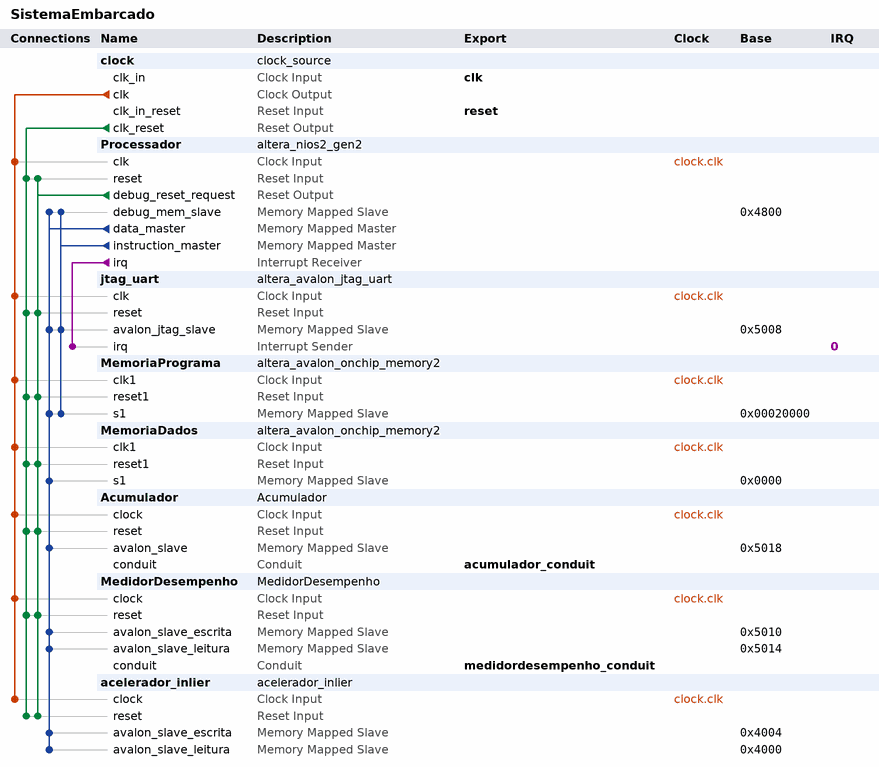
[diagram p0: system contents]
# Platform Designer (Qsys) system SistemaEmbarcado, Cyclone IV E EP4CE115F29C7
# Parameters at their usual value, and those the tool derives, are not listed.
package require -exact qsys 18.1
create_system SistemaEmbarcado
set_project_property DEVICE_FAMILY {Cyclone IV E}
set_project_property DEVICE EP4CE115F29C7

add_instance clock clock_source 18.1
set_instance_parameter_value clock clockFrequency 50000000

add_instance Processador altera_nios2_gen2 18.1
set_instance_parameter_value Processador dcache_size 2048
set_instance_parameter_value Processador exceptionSlave MemoriaPrograma.s1
set_instance_parameter_value Processador icache_size 4096
set_instance_parameter_value Processador impl Tiny
set_instance_parameter_value Processador resetSlave MemoriaPrograma.s1

add_instance jtag_uart altera_avalon_jtag_uart 18.1
set_instance_parameter_value jtag_uart simInteractiveOptions NO_INTERACTIVE_WINDOWS

add_instance MemoriaPrograma altera_avalon_onchip_memory2 18.1
set_instance_parameter_value MemoriaPrograma dataWidth 32
set_instance_parameter_value MemoriaPrograma dualPort false
set_instance_parameter_value MemoriaPrograma initMemContent true
set_instance_parameter_value MemoriaPrograma initializationFileName onchip_mem.hex
set_instance_parameter_value MemoriaPrograma memorySize 65536

add_instance MemoriaDados altera_avalon_onchip_memory2 18.1
set_instance_parameter_value MemoriaDados dataWidth 32
set_instance_parameter_value MemoriaDados dualPort false
set_instance_parameter_value MemoriaDados initMemContent false
set_instance_parameter_value MemoriaDados initializationFileName D:/Projetos/Quartus/AcumuladorNios/MemoriaDados.mif
set_instance_parameter_value MemoriaDados memorySize 16384

add_instance Acumulador Acumulador 1.0

add_instance MedidorDesempenho MedidorDesempenho 1.0

add_instance acelerador_inlier acelerador_inlier 1.0

# connections
add_connection clock.clk acelerador_inlier.clock clock
add_connection clock.clk Acumulador.clock clock
add_connection clock.clk jtag_uart.clk clock
add_connection clock.clk MedidorDesempenho.clock clock
add_connection clock.clk MemoriaDados.clk1 clock
add_connection clock.clk MemoriaPrograma.clk1 clock
add_connection clock.clk Processador.clk clock
add_connection clock.clk_reset acelerador_inlier.reset reset
add_connection clock.clk_reset Acumulador.reset reset
add_connection clock.clk_reset jtag_uart.reset reset
add_connection clock.clk_reset MedidorDesempenho.reset reset
add_connection clock.clk_reset MemoriaDados.reset1 reset
add_connection clock.clk_reset MemoriaPrograma.reset1 reset
add_connection clock.clk_reset Processador.reset reset
add_connection Processador.debug_reset_request acelerador_inlier.reset reset
add_connection Processador.debug_reset_request Acumulador.reset reset
add_connection Processador.debug_reset_request jtag_uart.reset reset
add_connection Processador.debug_reset_request MedidorDesempenho.reset reset
add_connection Processador.debug_reset_request MemoriaDados.reset1 reset
add_connection Processador.debug_reset_request MemoriaPrograma.reset1 reset
add_connection Processador.debug_reset_request Processador.reset reset
add_connection Processador.data_master acelerador_inlier.avalon_slave_escrita avalon
set_connection_parameter_value Processador.data_master/acelerador_inlier.avalon_slave_escrita baseAddress 0x4004
add_connection Processador.data_master acelerador_inlier.avalon_slave_leitura avalon
set_connection_parameter_value Processador.data_master/acelerador_inlier.avalon_slave_leitura baseAddress 0x4000
add_connection Processador.data_master Acumulador.avalon_slave avalon
set_connection_parameter_value Processador.data_master/Acumulador.avalon_slave baseAddress 0x5018
add_connection Processador.data_master jtag_uart.avalon_jtag_slave avalon
set_connection_parameter_value Processador.data_master/jtag_uart.avalon_jtag_slave baseAddress 0x5008
add_connection Processador.data_master MedidorDesempenho.avalon_slave_escrita avalon
set_connection_parameter_value Processador.data_master/MedidorDesempenho.avalon_slave_escrita baseAddress 0x5010
add_connection Processador.data_master MedidorDesempenho.avalon_slave_leitura avalon
set_connection_parameter_value Processador.data_master/MedidorDesempenho.avalon_slave_leitura baseAddress 0x5014
add_connection Processador.data_master MemoriaDados.s1 avalon
set_connection_parameter_value Processador.data_master/MemoriaDados.s1 baseAddress 0x0000
add_connection Processador.data_master MemoriaPrograma.s1 avalon
set_connection_parameter_value Processador.data_master/MemoriaPrograma.s1 baseAddress 0x00020000
add_connection Processador.data_master Processador.debug_mem_slave avalon
set_connection_parameter_value Processador.data_master/Processador.debug_mem_slave baseAddress 0x4800
add_connection Processador.instruction_master jtag_uart.avalon_jtag_slave avalon
set_connection_parameter_value Processador.instruction_master/jtag_uart.avalon_jtag_slave baseAddress 0x5008
add_connection Processador.instruction_master MemoriaPrograma.s1 avalon
set_connection_parameter_value Processador.instruction_master/MemoriaPrograma.s1 baseAddress 0x00020000
add_connection Processador.instruction_master Processador.debug_mem_slave avalon
set_connection_parameter_value Processador.instruction_master/Processador.debug_mem_slave baseAddress 0x4800
add_connection Processador.irq jtag_uart.irq interrupt
set_connection_parameter_value Processador.irq/jtag_uart.irq irqNumber 0

# exported interfaces
add_interface acumulador_conduit conduit end
set_interface_property acumulador_conduit EXPORT_OF Acumulador.conduit
add_interface clk clock sink
set_interface_property clk EXPORT_OF clock.clk_in
add_interface medidordesempenho_conduit conduit end
set_interface_property medidordesempenho_conduit EXPORT_OF MedidorDesempenho.conduit
add_interface reset reset sink
set_interface_property reset EXPORT_OF clock.clk_in_reset

set_interconnect_requirement {$system} qsys_mm.clockCrossingAdapter HANDSHAKE
set_interconnect_requirement {$system} qsys_mm.enableEccProtection FALSE
set_interconnect_requirement {$system} qsys_mm.insertDefaultSlave FALSE
set_interconnect_requirement {$system} qsys_mm.maxAdditionalLatency 1

save_system SistemaEmbarcado.qsys
